# Altium project ui_board.PrjPCB
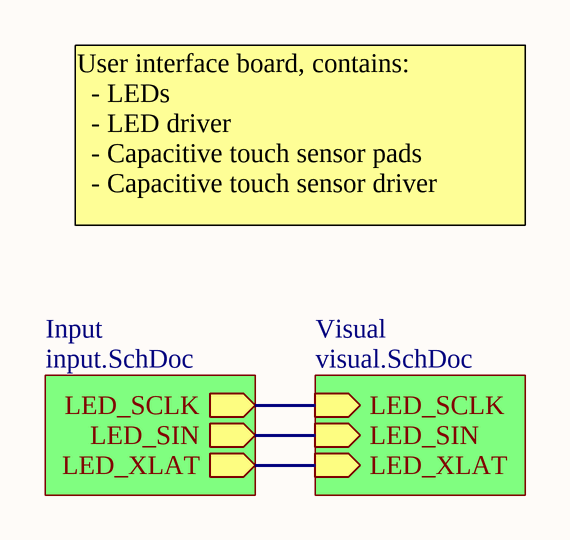
[diagram p0: ui_board_interconnect.SchDoc]
3 sheets, 44 parts. Net scope: hierarchical (ports join the sheet entries above them; power ports are global).
Board file: ui_board.PcbDoc
Sheets:
  ui_board_interconnect.SchDoc
    Input = input.SchDoc
    Visual = visual.SchDoc

## Sheet ui_board_interconnect.SchDoc
size A4

### Sub-sheets
Input = input.SchDoc: LED_SCLK (out), LED_SIN (out), LED_XLAT (out)
Visual = visual.SchDoc: LED_SCLK (in), LED_SIN (in), LED_XLAT (in)

### Nets
NetIC2_26: sheet Input/LED_XLAT, sheet Visual/LED_XLAT
NetIC2_31: sheet Input/LED_SCLK, sheet Visual/LED_SCLK
NetIC2_32: sheet Input/LED_SIN, sheet Visual/LED_SIN

### Notes on the sheet
- User interface board, contains:
  - LEDs
  - LED driver
  - Capacitive touch sensor pads
  - Capacitive touch sensor driver

## Sheet input.SchDoc
size A4
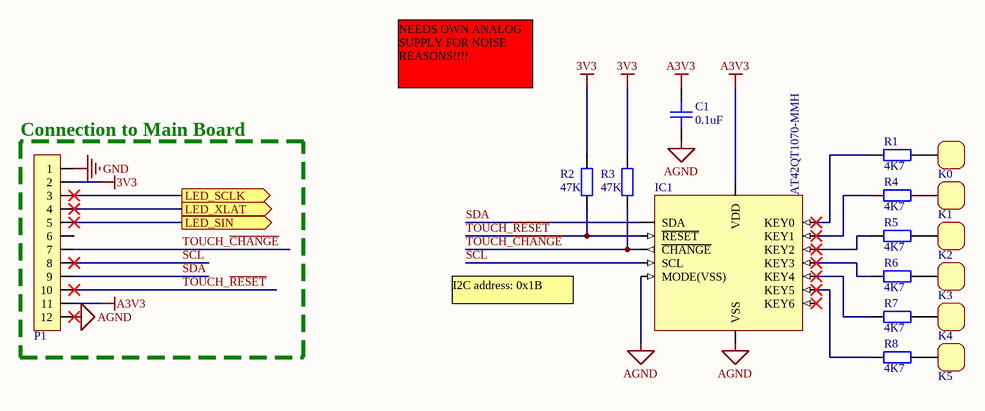
[diagram p1: input.SchDoc]

### Parts
C1  0.1uF  [1608[0603]_M]
IC1  AT42QT1070-MMH  [VQFN-20-EXPOSED-PAD_M]
K0  SELF-CAP-TOUCH-SENSOR-PAD  [TOUCH_SENSOR_SEED]  (value not drawn)
K1  SELF-CAP-TOUCH-SENSOR-PAD  [TOUCH_SENSOR_SEED]  (value not drawn)
K2  SELF-CAP-TOUCH-SENSOR-PAD  [TOUCH_SENSOR_SEED]  (value not drawn)
K3  SELF-CAP-TOUCH-SENSOR-PAD  [TOUCH_SENSOR_SEED]  (value not drawn)
K4  SELF-CAP-TOUCH-SENSOR-PAD  [TOUCH_SENSOR_SEED]  (value not drawn)
K5  SELF-CAP-TOUCH-SENSOR-PAD  [TOUCH_SENSOR_SEED]  (value not drawn)
P1  Connector 12  [FH33-12S-0.5SH_N]  (value not drawn)
R1  4K7  [1608[0603]_M]
R2  47K  [1608[0603]_M]
R3  47K  [1608[0603]_M]
R4  4K7  [1608[0603]_M]
R5  4K7  [1608[0603]_M]
R6  4K7  [1608[0603]_M]
R7  4K7  [1608[0603]_M]
R8  4K7  [1608[0603]_M]

### Blocks framed on the sheet
Connection to Main Board: P1

### Ports
LED_SCLK (out), LED_SIN (out), LED_XLAT (out)

### Nets
3V3: P1.2 R2.2 R3.2
A3V3: C1.2 IC1.9(VDD) P1.11
AGND: C1.1 IC1.8(VSS) IC1.11(MODE(VSS)) P1.12
GND: P1.1
SCL: IC1.15(SCL) P1.8
SDA: IC1.12(SDA) P1.9
TOUCH_~{CHANGE}: IC1.14(~{CHANGE}) P1.7 R3.1
TOUCH_~{RESET}: IC1.13(~{RESET}) P1.10 R2.1
NetIC1_1: IC1.1(KEY4) R7.2
NetIC1_2: IC1.2(KEY3) R6.2
NetIC1_3: IC1.3(KEY2) R5.2
NetIC1_4: IC1.4(KEY1) R4.2
NetIC1_5: IC1.5(KEY0) R1.2
NetIC1_17: IC1.17(KEY5) R8.2
NetIC2_26: P1.4 ; port LED_XLAT
NetIC2_31: P1.3 ; port LED_SCLK
NetIC2_32: P1.5 ; port LED_SIN
NetK0_1: K0.1 R1.1
NetK1_1: K1.1 R4.1
NetK2_1: K2.1 R5.1
NetK3_1: K3.1 R6.1
NetK4_1: K4.1 R7.1
NetK5_1: K5.1 R8.1

Not connected (* = marked no-connect by the designer): IC1 16(KEY6)*; P1 6

### Notes on the sheet
- NEEDS OWN ANALOG SUPPLY FOR NOISE REASONS!!!!
- I2C address: 0x1B

### Library data of the parts
C1 = Capacitor: Generic Capacitor; Value: 0.1uF
IC1 = AT42QT1070: Seven-channel capacitive touch sensor (Comms mode)
K0-K5 = SELF-CAP-TOUCH-SENSOR-PAD: Generic self-capacitance touch sensor pad
P1 = Connector 12: Connector 12-Pin
R1-R8 = Resistor: Generic Resistor
  R1 R4-R8: Value: 4K7
  R2 R3: Value: 47K

## Sheet visual.SchDoc
size A4
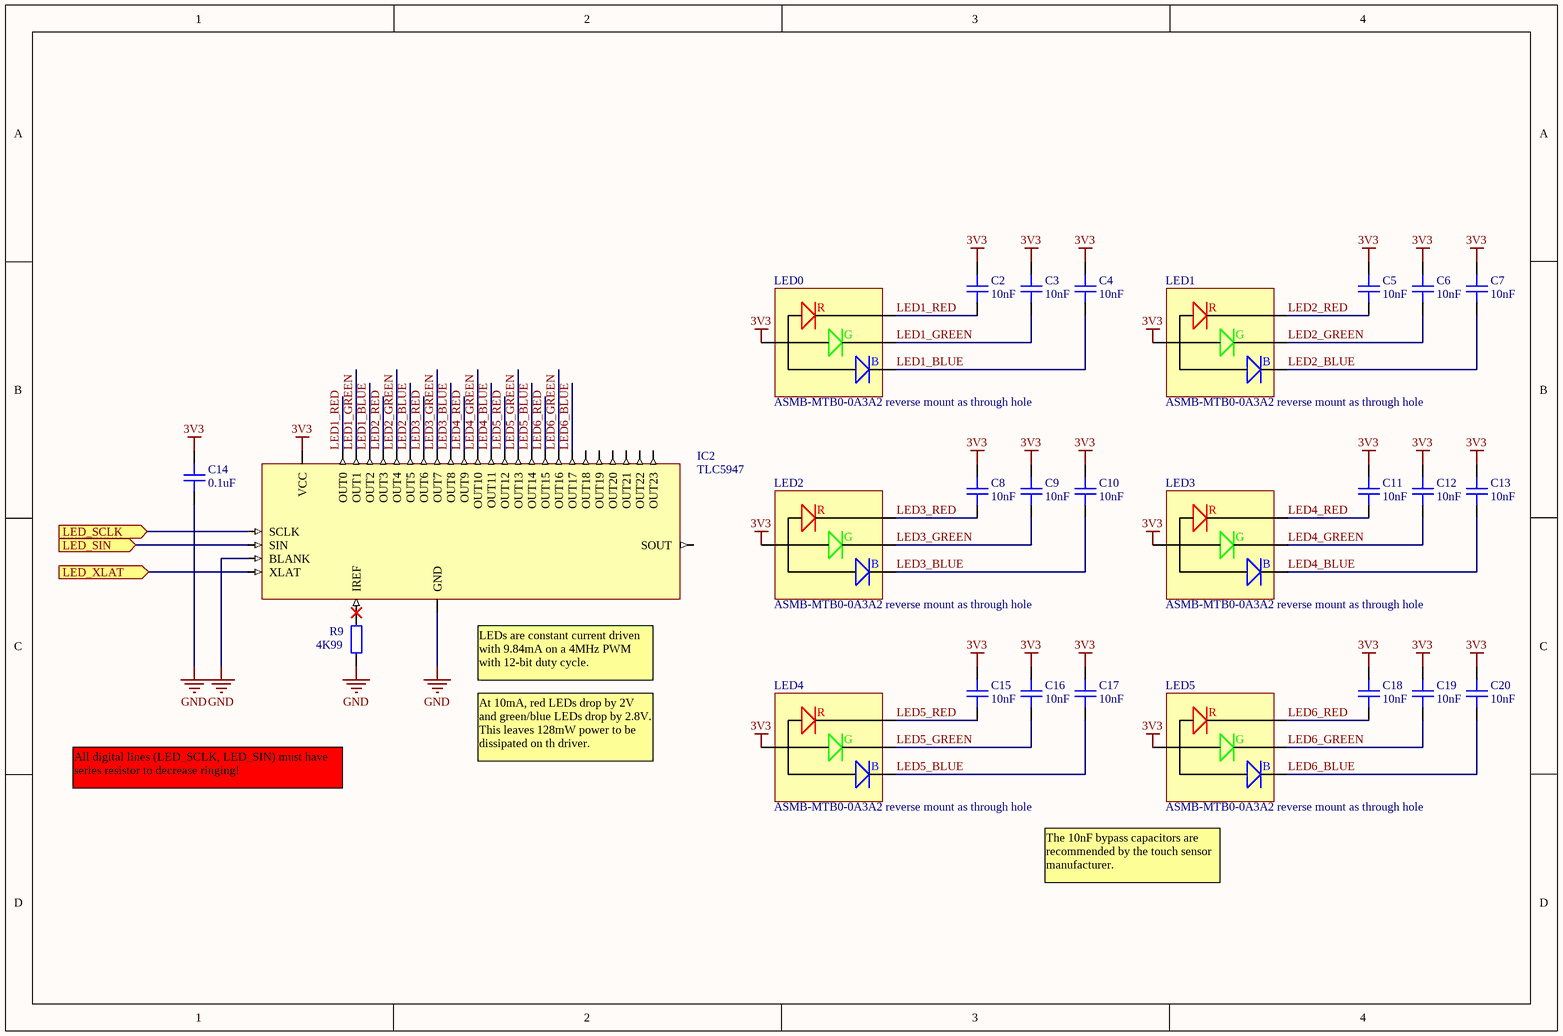
[diagram p2: visual.SchDoc]

### Parts
C2  10nF  [1608[0603]_M]
C3  10nF  [1608[0603]_M]
C4  10nF  [1608[0603]_M]
C5  10nF  [1608[0603]_M]
C6  10nF  [1608[0603]_M]
C7  10nF  [1608[0603]_M]
C8  10nF  [1608[0603]_M]
C9  10nF  [1608[0603]_M]
C10  10nF  [1608[0603]_M]
C11  10nF  [1608[0603]_M]
C12  10nF  [1608[0603]_M]
C13  10nF  [1608[0603]_M]
C14  0.1uF  [1608[0603]_M]
C15  10nF  [1608[0603]_M]
C16  10nF  [1608[0603]_M]
C17  10nF  [1608[0603]_M]
C18  10nF  [1608[0603]_M]
C19  10nF  [1608[0603]_M]
C20  10nF  [1608[0603]_M]
IC2  TLC5947  [VQFN-32_M]
LED0  ASMB-MTB0-0A3A2 reverse mount as through hole  [PLCC4-REVERSE-MOUNT_N]
LED1  ASMB-MTB0-0A3A2 reverse mount as through hole  [PLCC4-REVERSE-MOUNT_N]
LED2  ASMB-MTB0-0A3A2 reverse mount as through hole  [PLCC4-REVERSE-MOUNT_N]
LED3  ASMB-MTB0-0A3A2 reverse mount as through hole  [PLCC4-REVERSE-MOUNT_N]
LED4  ASMB-MTB0-0A3A2 reverse mount as through hole  [PLCC4-REVERSE-MOUNT_N]
LED5  ASMB-MTB0-0A3A2 reverse mount as through hole  [PLCC4-REVERSE-MOUNT_N]
R9  4K99  [1608[0603]_M]

### Ports
LED_SCLK (in), LED_SIN (in), LED_XLAT (in)

### Nets
3V3: C2.2 C3.2 C4.2 C5.2 C6.2 C7.2 C8.2 C9.2 C10.2 C11.2 C12.2 C13.2 C14.2 C15.2 C16.2 C17.2 C18.2 C19.2 C20.2 IC2.28(VCC) LED0.A LED1.A LED2.A LED3.A LED4.A LED5.A
GND: C14.1 IC2.29(GND) IC2.30(BLANK) R9.1
LED1_BLUE: C4.1 IC2.3(OUT2) LED0.BLUEK
LED1_GREEN: C3.1 IC2.2(OUT1) LED0.GREENK
LED1_RED: C2.1 IC2.1(OUT0) LED0.REDK
LED2_BLUE: C7.1 IC2.6(OUT5) LED1.BLUEK
LED2_GREEN: C6.1 IC2.5(OUT4) LED1.GREENK
LED2_RED: C5.1 IC2.4(OUT3) LED1.REDK
LED3_BLUE: C10.1 IC2.9(OUT8) LED2.BLUEK
LED3_GREEN: C9.1 IC2.8(OUT7) LED2.GREENK
LED3_RED: C8.1 IC2.7(OUT6) LED2.REDK
LED4_BLUE: C13.1 IC2.12(OUT11) LED3.BLUEK
LED4_GREEN: C12.1 IC2.11(OUT10) LED3.GREENK
LED4_RED: C11.1 IC2.10(OUT9) LED3.REDK
LED5_BLUE: C17.1 IC2.15(OUT14) LED4.BLUEK
LED5_GREEN: C16.1 IC2.14(OUT13) LED4.GREENK
LED5_RED: C15.1 IC2.13(OUT12) LED4.REDK
LED6_BLUE: C20.1 IC2.18(OUT17) LED5.BLUEK
LED6_GREEN: C19.1 IC2.17(OUT16) LED5.GREENK
LED6_RED: C18.1 IC2.16(OUT15) LED5.REDK
NetIC2_26: IC2.26(XLAT) ; port LED_XLAT
NetIC2_27: IC2.27(IREF) R9.2
NetIC2_31: IC2.31(SCLK) ; port LED_SCLK
NetIC2_32: IC2.32(SIN) ; port LED_SIN

Not connected (* = marked no-connect by the designer): IC2 19(OUT18) 20(OUT19) 21(OUT20) 22(OUT21) 23(OUT22) 24(OUT23) 25(SOUT)

### Notes on the sheet
- (near IC2) LEDs are constant current driven with 9.84mA on a 4MHz PWM with 12-bit duty cycle.
- All digital lines (LED_SCLK, LED_SIN) must have series resistor to decrease ringing!
- At 10mA, red LEDs drop by 2V and green/blue LEDs drop by 2.8V. This leaves 128mW power to be dissipated on th driver.
- The 10nF bypass capacitors are recommended by the touch sensor manufacturer.
- (in symbol RGB-LED-COMMON-ANODE) R; G; B

### Library data of the parts
C2-C20 = Capacitor: Generic Capacitor
  C2-C13 C15-C20: Value: 10nF
  C14: Value: 0.1uF
IC2 = TLC5947: 24-Channel, 12-Bit PWM LED Driver With Internal Oscillator
LED0-LED5 = RGB-LED-COMMON-ANODE: Generic RGB LED with common anode; pin to pad: A>1 BLUEK>2 GREENK>3 REDK>4; Value: ASMB-MTB0-0A3A2 reverse mount as through hole
R9 = Resistor: Generic Resistor; Value: 4K99

## Nets that join several sheets
3V3: input (P1.2 R2.2 R3.2), visual (26 pins)
GND: input (P1.1), visual (C14.1 IC2.29 IC2.30 R9.1)
NetIC2_26: input (P1.4), visual (IC2.26)
NetIC2_31: input (P1.3), visual (IC2.31)
NetIC2_32: input (P1.5), visual (IC2.32)